# Altium project FMC_P_CAM.PrjPCB
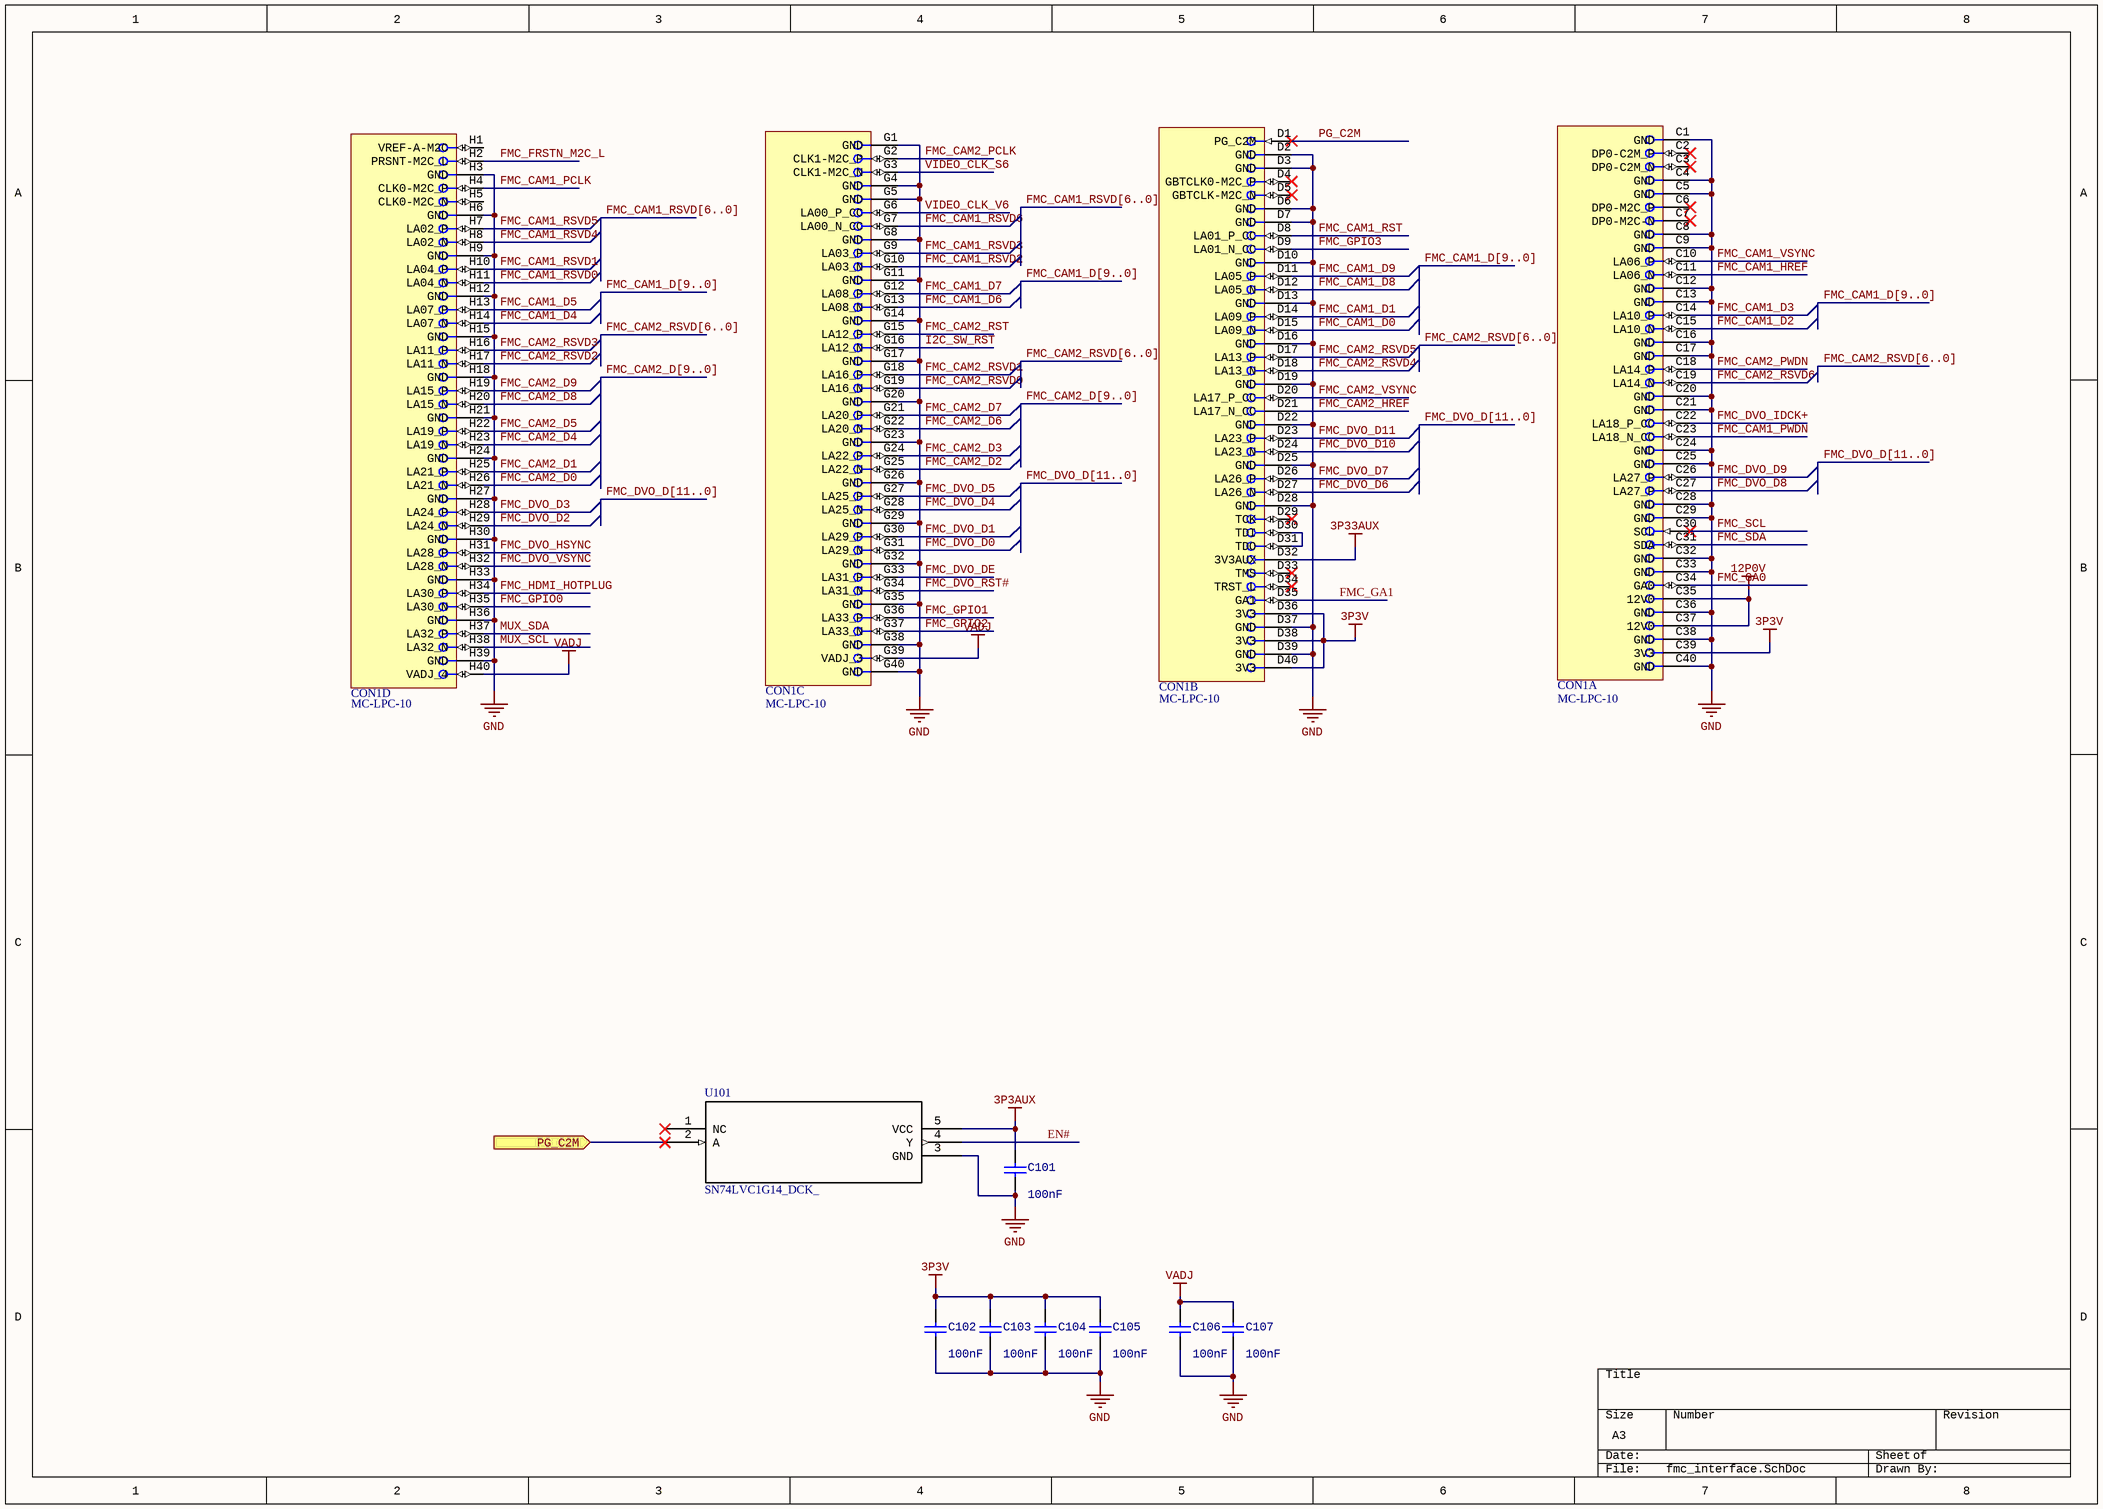
[diagram p0: fmc_interface.SchDoc]
5 sheets, 29 parts. Net scope: global (net labels, ports and power ports of the same name join across sheets).
Board file: FMC_P_CAM.PcbDoc
Sheets:
  fmc_interface.SchDoc
  i2c_video_clock.SchDoc
  camera_interface.SchDoc
  hdmi_interface.SchDoc
  gpio_interface.SchDoc

## Sheet fmc_interface.SchDoc
size A3

### Parts
C101  value 100nF  [1608[0603]]  (hidden comment: Cap)
C102  value 100nF  [1608[0603]]  (hidden comment: Cap)
C103  value 100nF  [1608[0603]]  (hidden comment: Cap)
C104  value 100nF  [1608[0603]]  (hidden comment: Cap)
C105  value 100nF  [1608[0603]]  (hidden comment: Cap)
C106  value 100nF  [1608[0603]]  (hidden comment: Cap)
C107  value 100nF  [1608[0603]]  (hidden comment: Cap)
CON1  MC-LPC-10  [ASP-134604-01]  (parts A,B,C,D of 4)
U101  SN74LVC1G14_DCK_  [DCK5]

### Ports
PG_C2M (in)

### Nets
3P3AUX: C101.2 U101.5(VCC)
3P3V: C102.2 C103.2 C104.2 C105.2 CON1.C39(3V3) CON1.D36(3V3) CON1.D38(3V3) CON1.D40(3V3)
3P33AUX: CON1.D32(3V3AUX)
12P0V: CON1.C35(12V0) CON1.C37(12V0)
GND: C101.1 C102.1 C103.1 C104.1 C105.1 C106.1 C107.1 CON1.C1(GND) CON1.C4(GND) CON1.C5(GND) CON1.C8(GND) CON1.C9(GND) CON1.C12(GND) CON1.C13(GND) CON1.C16(GND) CON1.C17(GND) CON1.C20(GND) CON1.C21(GND) CON1.C24(GND) CON1.C25(GND) CON1.C28(GND) CON1.C29(GND) CON1.C32(GND) CON1.C33(GND) CON1.C36(GND) CON1.C38(GND) CON1.C40(GND) CON1.D2(GND) CON1.D3(GND) CON1.D6(GND) CON1.D7(GND) CON1.D10(GND) CON1.D13(GND) CON1.D16(GND) CON1.D19(GND) CON1.D22(GND) CON1.D25(GND) CON1.D28(GND) CON1.D37(GND) CON1.D39(GND) CON1.G1(GND) CON1.G4(GND) CON1.G5(GND) CON1.G8(GND) CON1.G11(GND) CON1.G14(GND) CON1.G17(GND) CON1.G20(GND) CON1.G23(GND) CON1.G26(GND) CON1.G29(GND) CON1.G32(GND) CON1.G35(GND) CON1.G38(GND) CON1.G40(GND) CON1.H3(GND) CON1.H6(GND) CON1.H9(GND) CON1.H12(GND) CON1.H15(GND) CON1.H18(GND) CON1.H21(GND) CON1.H24(GND) CON1.H27(GND) CON1.H30(GND) CON1.H33(GND) CON1.H36(GND) CON1.H39(GND) U101.3(GND)
VADJ: C106.2 C107.2 CON1.G39(VADJ_3) CON1.H40(VADJ_4)
EN#: U101.4(Y)
FMC_CAM1_D0: CON1.D15(LA09_N)
FMC_CAM1_D1: CON1.D14(LA09_P)
FMC_CAM1_D2: CON1.C15(LA10_N)
FMC_CAM1_D3: CON1.C14(LA10_P)
FMC_CAM1_D4: CON1.H14(LA07_N)
FMC_CAM1_D5: CON1.H13(LA07_P)
FMC_CAM1_D6: CON1.G13(LA08_N)
FMC_CAM1_D7: CON1.G12(LA08_P)
FMC_CAM1_D8: CON1.D12(LA05_N)
FMC_CAM1_D9: CON1.D11(LA05_P)
FMC_CAM1_HREF: CON1.C11(LA06_N)
FMC_CAM1_PCLK: CON1.H4(CLK0-M2C_P)
FMC_CAM1_PWDN: CON1.C23(LA18_N_CC)
FMC_CAM1_RST: CON1.D8(LA01_P_CC)
FMC_CAM1_RSVD0: CON1.H11(LA04_N)
FMC_CAM1_RSVD1: CON1.H10(LA04_P)
FMC_CAM1_RSVD2: CON1.G10(LA03_N)
FMC_CAM1_RSVD3: CON1.G9(LA03_P)
FMC_CAM1_RSVD4: CON1.H8(LA02_N)
FMC_CAM1_RSVD5: CON1.H7(LA02_P)
FMC_CAM1_RSVD6: CON1.G7(LA00_N_CC)
FMC_CAM1_VSYNC: CON1.C10(LA06_P)
FMC_CAM2_D0: CON1.H26(LA21_N)
FMC_CAM2_D1: CON1.H25(LA21_P)
FMC_CAM2_D2: CON1.G25(LA22_N)
FMC_CAM2_D3: CON1.G24(LA22_P)
FMC_CAM2_D4: CON1.H23(LA19_N)
FMC_CAM2_D5: CON1.H22(LA19_P)
FMC_CAM2_D6: CON1.G22(LA20_N)
FMC_CAM2_D7: CON1.G21(LA20_P)
FMC_CAM2_D8: CON1.H20(LA15_N)
FMC_CAM2_D9: CON1.H19(LA15_P)
FMC_CAM2_HREF: CON1.D21(LA17_N_CC)
FMC_CAM2_PCLK: CON1.G2(CLK1-M2C_P)
FMC_CAM2_PWDN: CON1.C18(LA14_P)
FMC_CAM2_RST: CON1.G15(LA12_P)
FMC_CAM2_RSVD0: CON1.G19(LA16_N)
FMC_CAM2_RSVD1: CON1.G18(LA16_P)
FMC_CAM2_RSVD2: CON1.H17(LA11_N)
FMC_CAM2_RSVD3: CON1.H16(LA11_P)
FMC_CAM2_RSVD4: CON1.D18(LA13_N)
FMC_CAM2_RSVD5: CON1.D17(LA13_P)
FMC_CAM2_RSVD6: CON1.C19(LA14_N)
FMC_CAM2_VSYNC: CON1.D20(LA17_P_CC)
FMC_DVO_D0: CON1.G31(LA29_N)
FMC_DVO_D1: CON1.G30(LA29_P)
FMC_DVO_D2: CON1.H29(LA24_N)
FMC_DVO_D3: CON1.H28(LA24_P)
FMC_DVO_D4: CON1.G28(LA25_N)
FMC_DVO_D5: CON1.G27(LA25_P)
FMC_DVO_D6: CON1.D27(LA26_N)
FMC_DVO_D7: CON1.D26(LA26_P)
FMC_DVO_D8: CON1.C27(LA27_P)
FMC_DVO_D9: CON1.C26(LA27_P)
FMC_DVO_D10: CON1.D24(LA23_N)
FMC_DVO_D11: CON1.D23(LA23_P)
FMC_DVO_DE: CON1.G33(LA31_P)
FMC_DVO_HSYNC: CON1.H31(LA28_P)
FMC_DVO_IDCK+: CON1.C22(LA18_P_CC)
FMC_DVO_RST#: CON1.G34(LA31_N)
FMC_DVO_VSYNC: CON1.H32(LA28_N)
FMC_FRSTN_M2C_L: CON1.H2(PRSNT-M2C_L)
FMC_GA0: CON1.C34(GA0)
FMC_GA1: CON1.D35(GA1)
FMC_GPIO0: CON1.H35(LA30_N)
FMC_GPIO1: CON1.G36(LA33_P)
FMC_GPIO2: CON1.G37(LA33_N)
FMC_GPIO3: CON1.D9(LA01_N_CC)
FMC_HDMI_HOTPLUG: CON1.H34(LA30_P)
FMC_SCL: CON1.C30(SCL)
FMC_SDA: CON1.C31(SDA)
I2C_SW_RST: CON1.G16(LA12_N)
MUX_SCL: CON1.H38(LA32_N)
MUX_SDA: CON1.H37(LA32_P)
PG_C2M: CON1.D1(PG_C2M)
VIDEO_CLK_S6: CON1.G3(CLK1-M2C_N)
VIDEO_CLK_V6: CON1.G6(LA00_P_CC)
NetCON1_D30: CON1.D30(TDI) CON1.D31(TDO)
NetU101_2: U101.2(A) ; port PG_C2M

Not connected (* = marked no-connect by the designer): CON1 C2(DP0-C2M_P)* C3(DP0-C2M_N)* C6(DP0-M2C_P)* C7(DP0-M2C-N)* D4(GBTCLK0-M2C_P)* D5(GBTCLK-M2C_N)* D29(TCK)* D33(TMS)* D34(TRST_L)* H1(VREF-A-M2C) H5(CLK0-M2C_N); U101 1(NC)*

### Buses and harness runs
bus FMC_CAM1_D[9..0]
bus FMC_CAM1_RSVD[6..0]
bus FMC_CAM2_D[9..0]
bus FMC_CAM2_RSVD[6..0]
bus FMC_DVO_D[11..0]

### Library data of the parts
C101-C107 = Cap Semi: Capacitor (Semiconductor SIM Model); Published: 8-Jun-2000; LatestRevisionDate: 29-May-2009; LatestRevisionNote: IPC-7351 Footprint Added.; PackageReference: C1206; Publisher: Altium Limited; PackageDescription: Chip Capacitor
CON1 = CONNECTOR_VITA57_LPC: Connector VITA57 LPC; Manufacturer: Samtec; Specific: 4x40 contacts, stack height 10 mm; Type: Terminal (Module Side); Part Description: Connector VITA57 LPC; Part Number: ASP-134604-01; Distributor: Sibalco, Samtec; Distributor Part Number: ASP-134604-01; Value: MC-LPC-10; Supplier 1: Digi-Key; Supplier Part Number 1: SAM8732-ND
U101 = SN74LVC1G14_DCK_: Imported; Manufacturer: Texas Instruments; Manufacturer_Part_Number: sn74lvc1g14_dck_5; INDUSTRY_STD_PKG_TYPE: SC70; FAMILY_NAME: LL INVERTER; PIN_COUNT: 5; PACKAGE_DESIGNATOR: DCK; Datasheet URL: http://www.ti.com/lit/gpn/SN74LVC1G14; GENERIC_PART_NUMBER: SN74LVC1G14; Vendor: Texas Instruments; RefDes: RefDes; Type: DEV; Value: Value

## Sheet i2c_video_clock.SchDoc
size A3
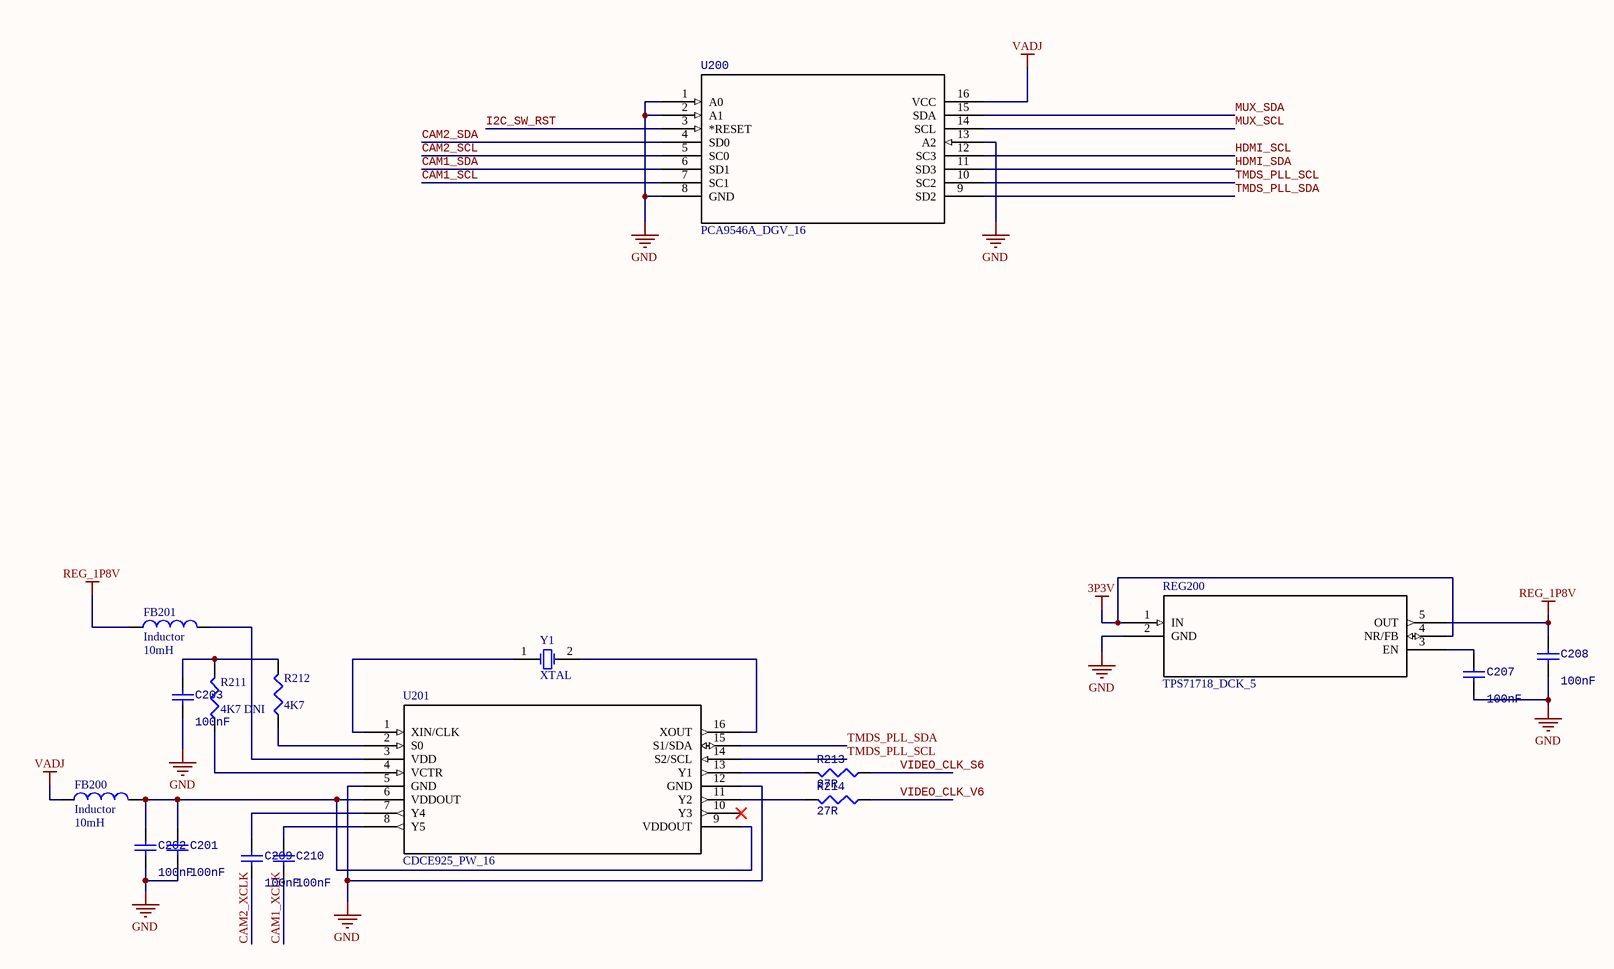
[diagram p1: i2c_video_clock.SchDoc]

### Parts
C201  value 100nF  [1608[0603]]  (hidden comment: Cap)
C202  value 100nF  [1608[0603]]  (hidden comment: Cap)
C203  value 100nF  [1608[0603]]  (hidden comment: Cap)
C207  value 100nF  [1608[0603]]  (hidden comment: Cap)
C208  value 100nF  [1608[0603]]  (hidden comment: Cap)
C209  value 100nF  [1608[0603]]  (hidden comment: Cap)
C210  value 100nF  [1608[0603]]  (hidden comment: Cap)
FB200  Inductor  value 10mH  [0603]
FB201  Inductor  value 10mH  [0603]
R211  value 4K7 DNI  [J1-0603]  (hidden comment: Res3)
R212  value 4K7  [J1-0603]  (hidden comment: Res3)
R213  value 27R  [J1-0603]  (hidden comment: Res3)
R214  value 27R  [J1-0603]  (hidden comment: Res3)
REG200  TPS71718_DCK_5  [DCK5]
U200  PCA9546A_DGV_16  [DGV16]
U201  CDCE925_PW_16  [PW16]
Y1  XTAL  [R38]

### Nets
3P3V: REG200.1(IN) REG200.4(NR/FB)
GND: C201.1 C202.1 C203.1 C207.1 C208.1 REG200.2(GND) U200.1(A0) U200.2(A1) U200.8(GND) U200.13(A2) U201.5(GND) U201.12(GND)
REG_1P8V: C208.2 FB201.1 REG200.5(OUT)
VADJ: FB200.1 U200.16(VCC)
CAM1_SCL: U200.7(SC1)
CAM1_SDA: U200.6(SD1)
CAM1_XCLK: C210.1
CAM2_SCL: U200.5(SC0)
CAM2_SDA: U200.4(SD0)
CAM2_XCLK: C209.1
HDMI_SCL: U200.12(SC3)
HDMI_SDA: U200.11(SD3)
I2C_SW_RST: U200.3(*RESET)
MUX_SCL: U200.14(SCL)
MUX_SDA: U200.15(SDA)
TMDS_PLL_SCL: U200.10(SC2) U201.14(S2/SCL)
TMDS_PLL_SDA: U200.9(SD2) U201.15(S1/SDA)
VIDEO_CLK_S6: R213.1
VIDEO_CLK_V6: R214.1
NetC201_2: C201.2 C202.2 FB200.2 U201.6(VDDOUT) U201.9(VDDOUT)
NetC203_2: C203.2 R211.2 R212.2
NetC207_2: C207.2 REG200.3(EN)
NetC209_2: C209.2 U201.7(Y4)
NetC210_2: C210.2 U201.8(Y5)
NetFB201_2: FB201.2 U201.3(VDD)
NetR211_1: R211.1 U201.4(VCTR)
NetR212_1: R212.1 U201.2(S0)
NetR213_2: R213.2 U201.13(Y1)
NetR214_2: R214.2 U201.11(Y2)
NetU201_1: U201.1(XIN/CLK) Y1.1(OSC1)
NetU201_16: U201.16(XOUT) Y1.2(OSC2)

Not connected (* = marked no-connect by the designer): U201 10(Y3)*

### Library data of the parts
C201-C203 C207-C210 = Cap Semi: Capacitor (Semiconductor SIM Model); Published: 8-Jun-2000; LatestRevisionDate: 29-May-2009; LatestRevisionNote: IPC-7351 Footprint Added.; PackageReference: C1206; Publisher: Altium Limited; PackageDescription: Chip Capacitor
FB200 FB201 = Inductor: Code_IEC: 1005; Published: 8-Jun-2000; LatestRevisionDate: 29-May-2009; LatestRevisionNote: IPC-7351 Footprint Added.; PackageReference: 0402-A; Publisher: Altium Limited; PackageDescription: Chip Inductor; Code_JEITA: 0402
R211-R214 = Res3: Resistor; Published: 8-Jun-2000; LatestRevisionDate: 29-May-2009; LatestRevisionNote: IPC-7351 Footprint Added.; PackageReference: J1-0603; Publisher: Altium Limited; PackageDescription: Chip Resistor
REG200 = TPS71718_DCK_5: Imported; Vendor: Texas Instruments; PACKAGE_DESIGNATOR: DCK; PIN_COUNT: 5; FAMILY_NAME: SINGLE CHANNEL LDO; INDUSTRY_STD_PKG_TYPE: SC70; Manufacturer_Part_Number: tps71718_dck_5; GENERIC_PART_NUMBER: TPS71718; Datasheet URL: http://www.ti.com/lit/gpn/TPS71718; Manufacturer: Texas Instruments; RefDes: RefDes; Type: DEV; Value: Value
U200 = PCA9546A_DGV_16: Imported; Manufacturer: Texas Instruments; INDUSTRY_STD_PKG_TYPE: TVSOP; FAMILY_NAME: I2C MULTIPLEXER, SWITCH; PIN_COUNT: 16; PACKAGE_DESIGNATOR: DGV; Datasheet URL: http://www.ti.com/lit/gpn/PCA9546A; GENERIC_PART_NUMBER: PCA9546A; Vendor: Texas Instruments; Manufacturer_Part_Number: pca9546a_dgv_16; RefDes: RefDes; Type: DEV; Value: Value
U201 = CDCE925_PW_16: Imported; Manufacturer: Texas Instruments; INDUSTRY_STD_PKG_TYPE: TSSOP; FAMILY_NAME: VCXO INPUT; PIN_COUNT: 16; PACKAGE_DESIGNATOR: PW; Datasheet URL: http://www.ti.com/lit/gpn/CDCE925; GENERIC_PART_NUMBER: CDCE925; RefDes: RefDes; Type: DEV; Value: Value
Y1 = XTAL: Crystal Oscillator; Published: 8-Jun-2000; LatestRevisionDate: 17-Jul-2002; LatestRevisionNote: Re-released for DXP Platform.; PackageReference: R38; Publisher: Altium Limited; PackageDescription: Crystal, Thru-Hole; 2 Leads; Body 3.1 x 8.2 mm (Dia.xH)

## Sheet camera_interface.SchDoc
size A3
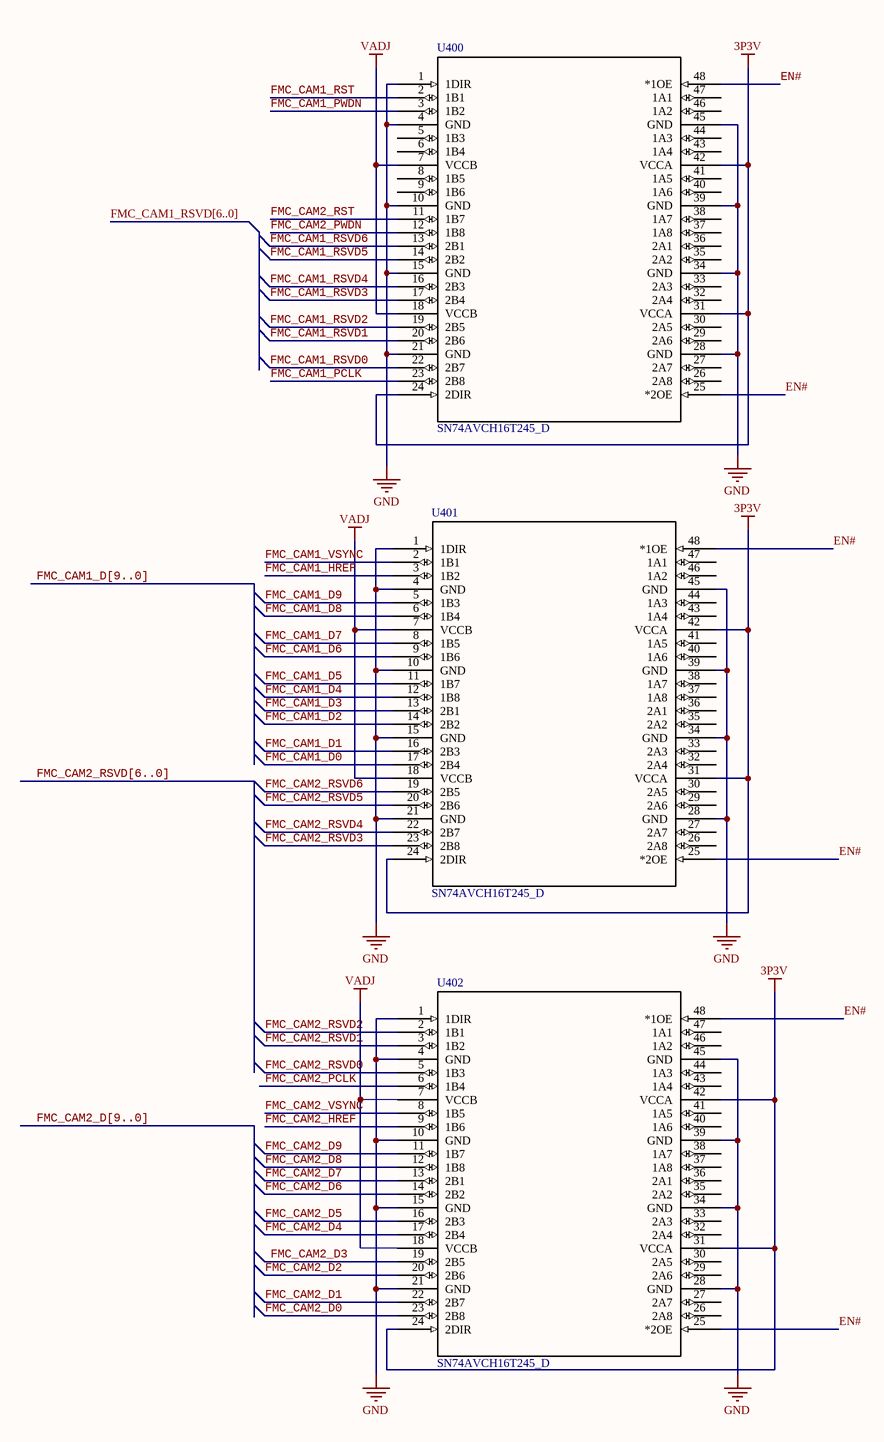
[diagram p2: camera_interface.SchDoc]

### Parts
U400  SN74AVCH16T245_D  [DGV48]
U401  SN74AVCH16T245_D  [DGV48]
U402  SN74AVCH16T245_D  [DGV48]

### Nets
3P3V: U400.24(2DIR) U400.31(VCCA) U400.42(VCCA) U401.24(2DIR) U401.31(VCCA) U401.42(VCCA) U402.24(2DIR) U402.31(VCCA) U402.42(VCCA)
GND: U400.1(1DIR) U400.4(GND) U400.10(GND) U400.15(GND) U400.21(GND) U400.28(GND) U400.34(GND) U400.39(GND) U400.45(GND) U401.1(1DIR) U401.4(GND) U401.10(GND) U401.15(GND) U401.21(GND) U401.28(GND) U401.34(GND) U401.39(GND) U401.45(GND) U402.1(1DIR) U402.4(GND) U402.10(GND) U402.15(GND) U402.21(GND) U402.28(GND) U402.34(GND) U402.39(GND) U402.45(GND)
VADJ: U400.7(VCCB) U400.18(VCCB) U401.7(VCCB) U401.18(VCCB) U402.7(VCCB) U402.18(VCCB)
EN#: U400.25(*2OE) U400.48(*1OE) U401.25(*2OE) U401.48(*1OE) U402.25(*2OE) U402.48(*1OE)
FMC_CAM1_D0: U401.17(2B4)
FMC_CAM1_D1: U401.16(2B3)
FMC_CAM1_D2: U401.14(2B2)
FMC_CAM1_D3: U401.13(2B1)
FMC_CAM1_D4: U401.12(1B8)
FMC_CAM1_D5: U401.11(1B7)
FMC_CAM1_D6: U401.9(1B6)
FMC_CAM1_D7: U401.8(1B5)
FMC_CAM1_D8: U401.6(1B4)
FMC_CAM1_D9: U401.5(1B3)
FMC_CAM1_HREF: U401.3(1B2)
FMC_CAM1_PCLK: U400.23(2B8)
FMC_CAM1_PWDN: U400.3(1B2)
FMC_CAM1_RST: U400.2(1B1)
FMC_CAM1_RSVD0: U400.22(2B7)
FMC_CAM1_RSVD1: U400.20(2B6)
FMC_CAM1_RSVD2: U400.19(2B5)
FMC_CAM1_RSVD3: U400.17(2B4)
FMC_CAM1_RSVD4: U400.16(2B3)
FMC_CAM1_RSVD5: U400.14(2B2)
FMC_CAM1_RSVD6: U400.13(2B1)
FMC_CAM1_VSYNC: U401.2(1B1)
FMC_CAM2_D0: U402.23(2B8)
FMC_CAM2_D1: U402.22(2B7)
FMC_CAM2_D2: U402.20(2B6)
FMC_CAM2_D3: U402.19(2B5)
FMC_CAM2_D4: U402.17(2B4)
FMC_CAM2_D5: U402.16(2B3)
FMC_CAM2_D6: U402.14(2B2)
FMC_CAM2_D7: U402.13(2B1)
FMC_CAM2_D8: U402.12(1B8)
FMC_CAM2_D9: U402.11(1B7)
FMC_CAM2_HREF: U402.9(1B6)
FMC_CAM2_PCLK: U402.6(1B4)
FMC_CAM2_PWDN: U400.12(1B8)
FMC_CAM2_RST: U400.11(1B7)
FMC_CAM2_RSVD0: U402.5(1B3)
FMC_CAM2_RSVD1: U402.3(1B2)
FMC_CAM2_RSVD2: U402.2(1B1)
FMC_CAM2_RSVD3: U401.23(2B8)
FMC_CAM2_RSVD4: U401.22(2B7)
FMC_CAM2_RSVD5: U401.20(2B6)
FMC_CAM2_RSVD6: U401.19(2B5)
FMC_CAM2_VSYNC: U402.8(1B5)

Not connected (* = marked no-connect by the designer): U400 5(1B3) 6(1B4) 8(1B5) 9(1B6) 26(2A8) 27(2A7) 29(2A6) 30(2A5) 32(2A4) 33(2A3) 35(2A2) 36(2A1) 37(1A8) 38(1A7) 40(1A6) 41(1A5) 43(1A4) 44(1A3) 46(1A2) 47(1A1); U401 26(2A8) 27(2A7) 29(2A6) 30(2A5) 32(2A4) 33(2A3) 35(2A2) 36(2A1) 37(1A8) 38(1A7) 40(1A6) 41(1A5) 43(1A4) 44(1A3) 46(1A2) 47(1A1); U402 26(2A8) 27(2A7) 29(2A6) 30(2A5) 32(2A4) 33(2A3) 35(2A2) 36(2A1) 37(1A8) 38(1A7) 40(1A6) 41(1A5) 43(1A4) 44(1A3) 46(1A2) 47(1A1)

### Buses and harness runs
bus FMC_CAM1_D[9..0]
bus FMC_CAM1_RSVD[6..0]
bus FMC_CAM2_D[9..0]
bus FMC_CAM2_RSVD[6..0]

### Library data of the parts
U400-U402 = SN74AVCH16T245_D: Imported; Manufacturer: Texas Instruments; Manufacturer_Part_Number: sn74avch16t245_dgv_48; INDUSTRY_STD_PKG_TYPE: TVSOP; FAMILY_NAME: DIRECTION CONTROL DUAL SUPPLY TRANSLATOR; PIN_COUNT: 48; PACKAGE_DESIGNATOR: DGV; Datasheet URL: http://www.ti.com/lit/gpn/SN74AVCH16T245; GENERIC_PART_NUMBER: SN74AVCH16T245; Vendor: Texas Instruments; RefDes: RefDes; Type: DEV; Value: Value

## Sheet hdmi_interface.SchDoc: Camera Interface
size A3

## Sheet gpio_interface.SchDoc
size A3

## Nets that join several sheets
3P3V: fmc_interface (8 pins), i2c_video_clock (REG200.1 REG200.4), camera_interface (9 pins)
GND: fmc_interface (69 pins), i2c_video_clock (12 pins), camera_interface (27 pins)
VADJ: fmc_interface (C106.2 C107.2 CON1.G39 CON1.H40), i2c_video_clock (FB200.1 U200.16), camera_interface (6 pins)
EN#: fmc_interface (U101.4), camera_interface (6 pins)
FMC_CAM1_D0: fmc_interface (CON1.D15), camera_interface (U401.17)
FMC_CAM1_D1: fmc_interface (CON1.D14), camera_interface (U401.16)
FMC_CAM1_D2: fmc_interface (CON1.C15), camera_interface (U401.14)
FMC_CAM1_D3: fmc_interface (CON1.C14), camera_interface (U401.13)
FMC_CAM1_D4: fmc_interface (CON1.H14), camera_interface (U401.12)
FMC_CAM1_D5: fmc_interface (CON1.H13), camera_interface (U401.11)
FMC_CAM1_D6: fmc_interface (CON1.G13), camera_interface (U401.9)
FMC_CAM1_D7: fmc_interface (CON1.G12), camera_interface (U401.8)
FMC_CAM1_D8: fmc_interface (CON1.D12), camera_interface (U401.6)
FMC_CAM1_D9: fmc_interface (CON1.D11), camera_interface (U401.5)
FMC_CAM1_HREF: fmc_interface (CON1.C11), camera_interface (U401.3)
FMC_CAM1_PCLK: fmc_interface (CON1.H4), camera_interface (U400.23)
FMC_CAM1_PWDN: fmc_interface (CON1.C23), camera_interface (U400.3)
FMC_CAM1_RST: fmc_interface (CON1.D8), camera_interface (U400.2)
FMC_CAM1_RSVD0: fmc_interface (CON1.H11), camera_interface (U400.22)
FMC_CAM1_RSVD1: fmc_interface (CON1.H10), camera_interface (U400.20)
FMC_CAM1_RSVD2: fmc_interface (CON1.G10), camera_interface (U400.19)
FMC_CAM1_RSVD3: fmc_interface (CON1.G9), camera_interface (U400.17)
FMC_CAM1_RSVD4: fmc_interface (CON1.H8), camera_interface (U400.16)
FMC_CAM1_RSVD5: fmc_interface (CON1.H7), camera_interface (U400.14)
FMC_CAM1_RSVD6: fmc_interface (CON1.G7), camera_interface (U400.13)
FMC_CAM1_VSYNC: fmc_interface (CON1.C10), camera_interface (U401.2)
FMC_CAM2_D0: fmc_interface (CON1.H26), camera_interface (U402.23)
FMC_CAM2_D1: fmc_interface (CON1.H25), camera_interface (U402.22)
FMC_CAM2_D2: fmc_interface (CON1.G25), camera_interface (U402.20)
FMC_CAM2_D3: fmc_interface (CON1.G24), camera_interface (U402.19)
FMC_CAM2_D4: fmc_interface (CON1.H23), camera_interface (U402.17)
FMC_CAM2_D5: fmc_interface (CON1.H22), camera_interface (U402.16)
FMC_CAM2_D6: fmc_interface (CON1.G22), camera_interface (U402.14)
FMC_CAM2_D7: fmc_interface (CON1.G21), camera_interface (U402.13)
FMC_CAM2_D8: fmc_interface (CON1.H20), camera_interface (U402.12)
FMC_CAM2_D9: fmc_interface (CON1.H19), camera_interface (U402.11)
FMC_CAM2_HREF: fmc_interface (CON1.D21), camera_interface (U402.9)
FMC_CAM2_PCLK: fmc_interface (CON1.G2), camera_interface (U402.6)
FMC_CAM2_PWDN: fmc_interface (CON1.C18), camera_interface (U400.12)
FMC_CAM2_RST: fmc_interface (CON1.G15), camera_interface (U400.11)
FMC_CAM2_RSVD0: fmc_interface (CON1.G19), camera_interface (U402.5)
FMC_CAM2_RSVD1: fmc_interface (CON1.G18), camera_interface (U402.3)
FMC_CAM2_RSVD2: fmc_interface (CON1.H17), camera_interface (U402.2)
FMC_CAM2_RSVD3: fmc_interface (CON1.H16), camera_interface (U401.23)
FMC_CAM2_RSVD4: fmc_interface (CON1.D18), camera_interface (U401.22)
FMC_CAM2_RSVD5: fmc_interface (CON1.D17), camera_interface (U401.20)
FMC_CAM2_RSVD6: fmc_interface (CON1.C19), camera_interface (U401.19)
FMC_CAM2_VSYNC: fmc_interface (CON1.D20), camera_interface (U402.8)
I2C_SW_RST: fmc_interface (CON1.G16), i2c_video_clock (U200.3)
MUX_SCL: fmc_interface (CON1.H38), i2c_video_clock (U200.14)
MUX_SDA: fmc_interface (CON1.H37), i2c_video_clock (U200.15)
VIDEO_CLK_S6: fmc_interface (CON1.G3), i2c_video_clock (R213.1)
VIDEO_CLK_V6: fmc_interface (CON1.G6), i2c_video_clock (R214.1)